# EAGLE schematic PCB-SPKTRLIGHT (EAGLE 6.2)
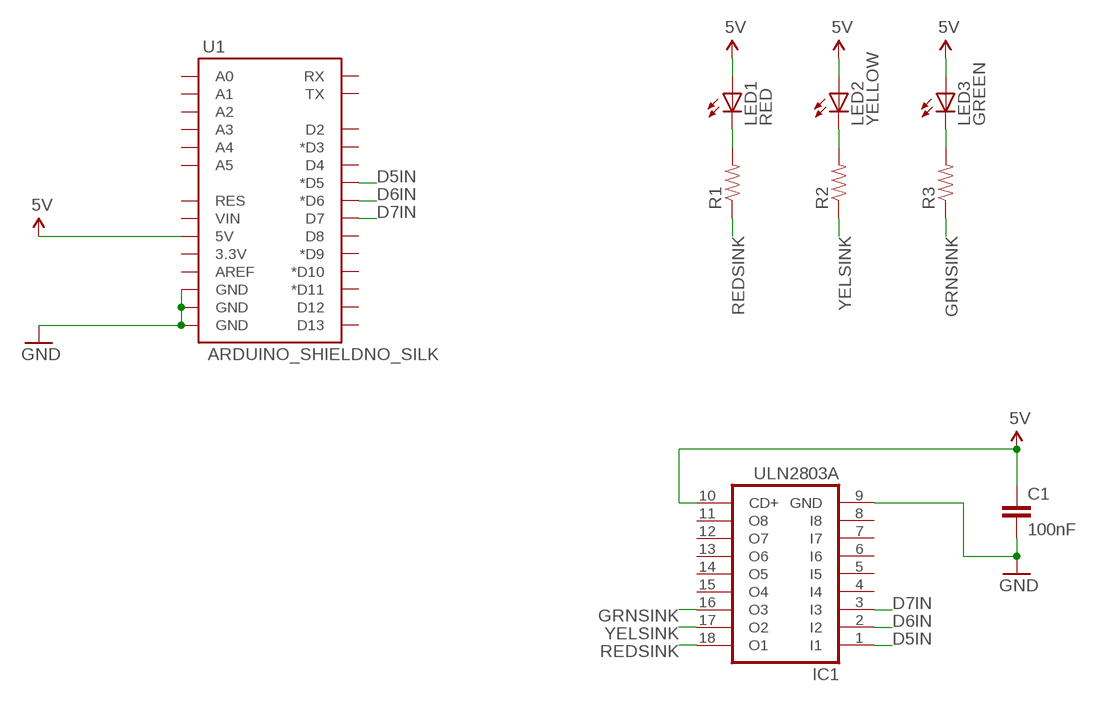
[diagram p0: schematic, sheet 1]

## Parts
C1  100nF  CAP0805  [0805]
IC1  ULN2803A  ULN2803ASO18W  [SO18W]
LED1  RED  LED5MM  [LED5MM]
LED2  YELLOW  LED5MM  [LED5MM]
LED3  GREEN  LED5MM  [LED5MM]
R1  RESISTORPTH-1/4W  [AXIAL-0.4]
R2  RESISTORPTH-1/4W  [AXIAL-0.4]
R3  RESISTORPTH-1/4W  [AXIAL-0.4]
U1  ARDUINO_SHIELDNO_SILK  [DUEMILANOVE_VIAS]

## Nets
5V [PWR]: C1.1 IC1.10(CD+) LED1.A LED2.A LED3.A U1.5V
D5IN: IC1.1(I1) U1.D5(*D5)
D6IN: IC1.2(I2) U1.D6(*D6)
D7IN: IC1.3(I3) U1.D7
GND [PWR]: C1.2 IC1.9(GND) U1.GND@0(GND) U1.GND@1(GND) U1.GND@2(GND)
GRNSINK: IC1.16(O3) R3.P$1
N$1: LED1.K(C) R1.P$2
N$2: LED2.K(C) R2.P$2
N$3: LED3.K(C) R3.P$2
REDSINK: IC1.18(O1) R1.P$1
YELSINK: IC1.17(O2) R2.P$1
Unconnected: IC1.4(I4) IC1.5(I5) IC1.6(I6) IC1.7(I7) IC1.8(I8) IC1.11(O8) IC1.12(O7) IC1.13(O6) IC1.14(O5) IC1.15(O4) U1.3.3V U1.A0 U1.A1 U1.A2 U1.A3 U1.A4 U1.A5 U1.AREF U1.D2 U1.D3(*D3) U1.D4 U1.D8 U1.D9(*D9) U1.D10(*D10) U1.D11(*D11) U1.D12 U1.D13 U1.RES U1.RX U1.TX U1.VIN

## Library data of the parts
C1 = SparkFun:CAP: Capacitor Standard 0603 ceramic capacitor, and 0.1" leaded capacitor.
IC1 = uln-udn:ULN2803A: DRIVER ARRAY
LED1-LED3 = SparkFun:LED: LEDs Standard schematic elements and footprints for 5mm, 3mm, 1206, and 0603 sized LEDs. 5mm - Spark Fun Electronics SKU : COM-00529 (and others)
R1-R3 = SparkFun:RESISTOR: Resistor Basic schematic elements and footprints for 0603, 1206, and PTH resistors.
U1 = SparkFun:ARDUINO_SHIELD

## Net classes
0 default: width 0.203 mm, drill 0.406 mm, clearance 0.203 mm
1 PWR: width 0.406 mm, drill 0.61 mm, clearance 0.203 mm